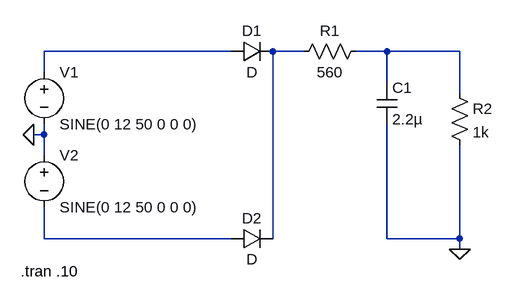
[diagram p0: schematic problema0.asc]
problema0.asc, the LTspice schematic file:
Version 4
SHEET 1 880 680
WIRE 352 80 64 80
WIRE 464 80 416 80
WIRE 592 80 544 80
WIRE 704 80 592 80
WIRE 64 112 64 80
WIRE 592 128 592 80
WIRE 704 144 704 80
WIRE 64 208 64 192
WIRE 64 208 48 208
WIRE 64 240 64 208
WIRE 64 368 64 320
WIRE 352 368 64 368
WIRE 416 368 416 80
WIRE 592 368 592 192
WIRE 704 368 704 224
WIRE 704 368 592 368
WIRE 704 384 704 368
FLAG 48 208 0
FLAG 704 384 0
SYMBOL voltage 64 96 R0
WINDOW 123 0 0 Left 0
WINDOW 39 0 0 Left 0
SYMATTR InstName V1
SYMATTR Value SINE(0 12 50 0 0 0)
SYMBOL voltage 64 224 R0
WINDOW 123 0 0 Left 0
WINDOW 39 0 0 Left 0
SYMATTR InstName V2
SYMATTR Value SINE(0 12 50 0 0 0)
SYMBOL diode 352 96 R270
WINDOW 0 32 32 VTop 2
WINDOW 3 0 32 VBottom 2
SYMATTR InstName D1
SYMBOL diode 352 384 R270
WINDOW 0 32 32 VTop 2
WINDOW 3 0 32 VBottom 2
SYMATTR InstName D2
SYMBOL res 560 64 R90
WINDOW 0 0 56 VBottom 2
WINDOW 3 32 56 VTop 2
SYMATTR InstName R1
SYMATTR Value 560
SYMBOL cap 576 128 R0
SYMATTR InstName C1
SYMATTR Value 2.2µ
SYMBOL res 688 128 R0
SYMATTR InstName R2
SYMATTR Value 1k
TEXT 28 418 Left 2 !.tran .10

The netlist it stands for:
* problema0.asc
V1 N001 0 SINE(0 12 50 0 0 0)
V2 0 N004 SINE(0 12 50 0 0 0)
D1 N001 N002 D
D2 N004 N002 D
R1 N003 N002 560
C1 N003 0 2.2µ
R2 N003 0 1k
.model D D
.lib standard.dio
.tran .10
.backanno
.end